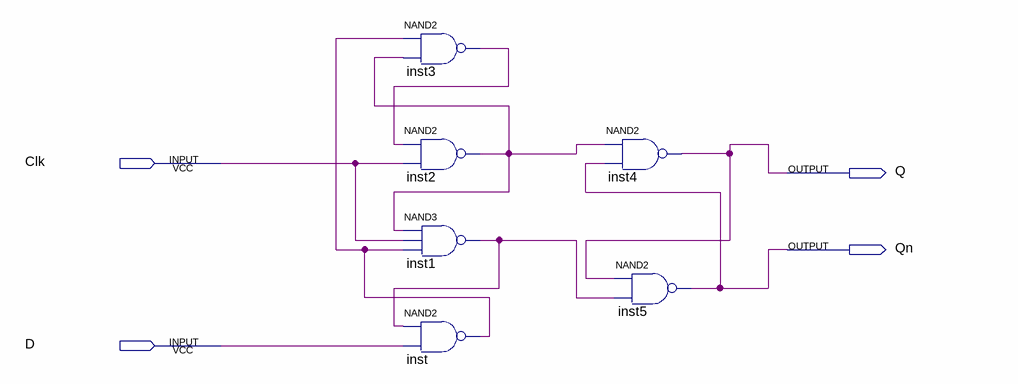
[diagram p0: schematic sheet]
// Quartus schematic lab9step3b.bdf as structural Verilog: 6 symbols, 4 pins
module lab9step3b (
  input  Clk,
  input  D,
  output Q,
  output Qn
);

  wire inst1_out, inst2_out, inst3_out, inst_out;

  nand inst3 (inst3_out, inst_out, inst2_out);
  nand inst2 (inst2_out, inst3_out, Clk);
  nand inst1 (inst1_out, inst2_out, Clk, inst_out);
  nand inst (inst_out, inst1_out, D);
  nand inst4 (Q, inst2_out, Qn);
  nand inst5 (Qn, Q, inst1_out);
endmodule
